# Altium schematic sheet motor.SchDoc
size A4; SheetNumber: 4; SheetTotal: 4
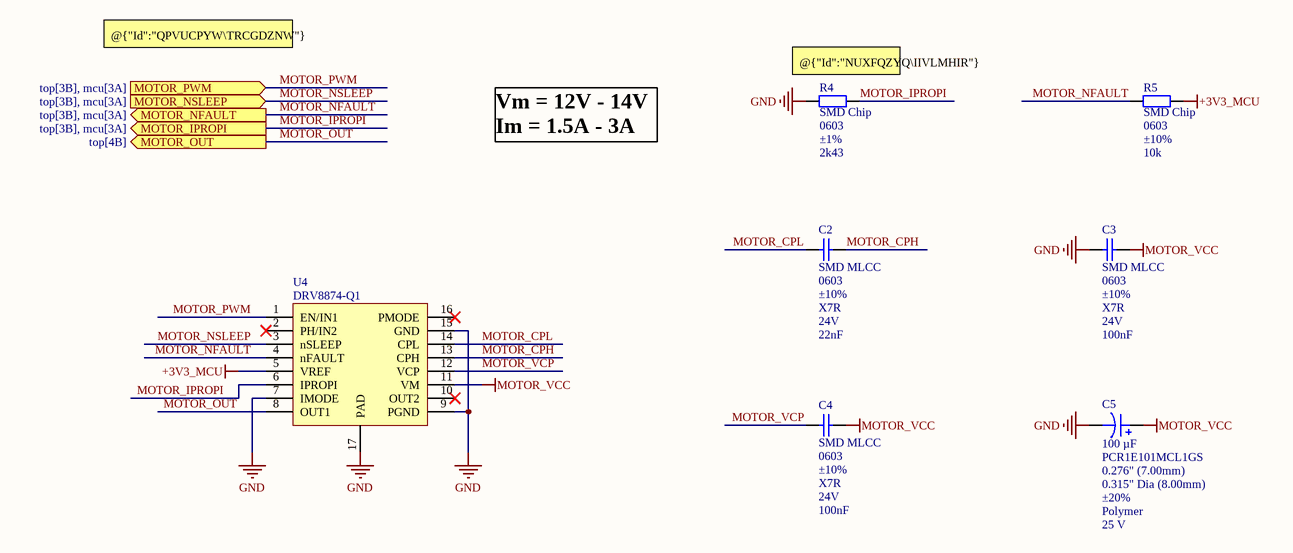
[diagram p0: motor.SchDoc]

## Parts
C2  SMD MLCC  Size: 0603  Tolerance: ±10%  Dielectric: X7R  VoltageRating: 24V  Capacitance: 22nF  [SMD_MLCC_CAPACITOR_0603]
C3  SMD MLCC  Size: 0603  Tolerance: ±10%  Dielectric: X7R  VoltageRating: 24V  Capacitance: 100nF  [SMD_MLCC_CAPACITOR_0603]
C4  SMD MLCC  Size: 0603  Tolerance: ±10%  Dielectric: X7R  VoltageRating: 24V  Capacitance: 100nF  [SMD_MLCC_CAPACITOR_0603]
C5  100 µF  Part Number: PCR1E101MCL1GS  Height - Seated (Max): 0.276" (7.00mm)  Size / Dimension: 0.315" Dia (8.00mm)  Tolerance: ±20%  Type: Polymer  Voltage - Rated: 25 V  [CAP ALSMD POLY 8.3MM H7.0MM]
R4  SMD Chip  Size: 0603  Tolerance: ±1%  Resistance: 2k43  [SMD_CHIP_RESISTOR_0603]
R5  SMD Chip  Size: 0603  Tolerance: ±10%  Resistance: 10k  [SMD_CHIP_RESISTOR_0603]
U4  DRV8874-Q1  [DRV8874-Q1]

## Ports
MOTOR_IPROPI (out, see top[3B], mcu[3A]), MOTOR_NFAULT (out, see top[3B], mcu[3A]), MOTOR_NSLEEP (in, see top[3B], mcu[3A]), MOTOR_OUT (out, see top[4B]), MOTOR_PWM (in, see top[3B], mcu[3A])

## Nets
+3V3_MCU: R5.2 U4.5(VREF)
GND: C3.2 C5.2 R4.1 U4.7(IMODE) U4.9(PGND) U4.15(GND) U4.17(PAD)
MOTOR_VCC: C3.1 C4.2 C5.1 U4.11(VM)
MOTOR_CPH: C2.2 U4.13(CPH)
MOTOR_CPL: C2.1 U4.14(CPL)
MOTOR_IPROPI: R4.2 U4.6(IPROPI) ; port MOTOR_IPROPI
MOTOR_NFAULT: R5.1 U4.4(nFAULT) ; port MOTOR_NFAULT
MOTOR_NSLEEP: U4.3(nSLEEP) ; port MOTOR_NSLEEP
MOTOR_OUT: U4.8(OUT1) ; port MOTOR_OUT
MOTOR_PWM: U4.1(EN/IN1) ; port MOTOR_PWM
MOTOR_VCP: C4.1 U4.12(VCP)

Not connected (* = marked no-connect by the designer): U4 2(PH/IN2)* 10(OUT2)* 16(PMODE)*

## Notes on the sheet
- @{"Id":"QPVUCPYW\TRCGDZNW"} max 100kHz
- (near R4) @{"Id":"NUXFQZYQ\IIVLMHIR"} Iod <= 5mA
- Vm = 12V - 14V
  Im = 1.5A - 3A

## Library data of the parts
C2-C4 = SMD MLCC Capacitor: generic SMD MLCC capacitor
C5 = PCR1E101MCL1GS: CAP ALUM POLY 100UF 20% 25V SMD; manufacturer: Nichicon; ESR (Equivalent Series Resistance): 41mOhm; Lifetime @ Temp.: 4000 Hrs @ 125°C; Ripple Current @ High Frequency: 1.2 A @ 100 kHz; Surface Mount Land Size: 0.327" L x 0.327" W (8.30mm x 8.30mm); Applications: Automotive; Capacitance: 100 µF; componentlink1description: Datasheet; componentlink1url: http://nichicon-us.com/english/products/pdfs/e-pcr.pdf; componentlink2description: DigiKey Link; componentlink2url: https://www.digikey.com/en/products/detail/nichicon/PCR1E101MCL1GS/4694651; Device Package: Radial, Can - SMD; lastupdated: 1. 12. 2023 21:37:41; Lifecycle Status: Active; Minimum Order: 1; Mounting Type: Surface Mount; Operating Temperature: -55°C ~ 125°C; Package / Case: Radial, Can - SMD; packaging: TapeAndReel; partid: 2447; Part Status: Active; price: 0.76; Ratings: AEC-Q200; series: PCR; Supplier 1: DigiKey; Supplier Part Number 1: 493-13751-1-ND; value: 100 µF
R4 R5 = SMD Chip Resistor: generic SMD chip resistor; PowerRating: /
U4 = DRV8874-Q1: brushed DC motor driver; Supplier 1: Mouser; Supplier Part Number 1: 595-DRV8874QPWPRQ1